# Altium schematic sheet 2_Connection.SchDoc
size 414 x 293 mm; SheetNumber: 2; SheetTotal: 3; PageSetup: Record=PageOptionsZCenterHorizontal=TrueZCenterVertical=TrueZPrintScale=1.00ZXCorrection=0.00ZYCorrection=0.00ZPrintKind=1ZBorderSize=5000000ZLeftOffset=0ZBottomOffset=0ZOrientation=2ZPaperLength=1000ZPaperWidth=1000ZScale=100ZPaperSource=7ZPrintQuality=-4ZMediaType=1ZDitherType=10ZPaperKind=A3ZPrintScaleMode=0; Razrabotal: {Разработал}; Proveril: {Проверил}; Tkontr: {Т.контр.}; Nkontr: {Н.контр.}; Ytverdil: {Утвердил}; Nazvanie1: {Название1}; Nazvanie2: {Название2}; Oboznachenie: {Обозначение}
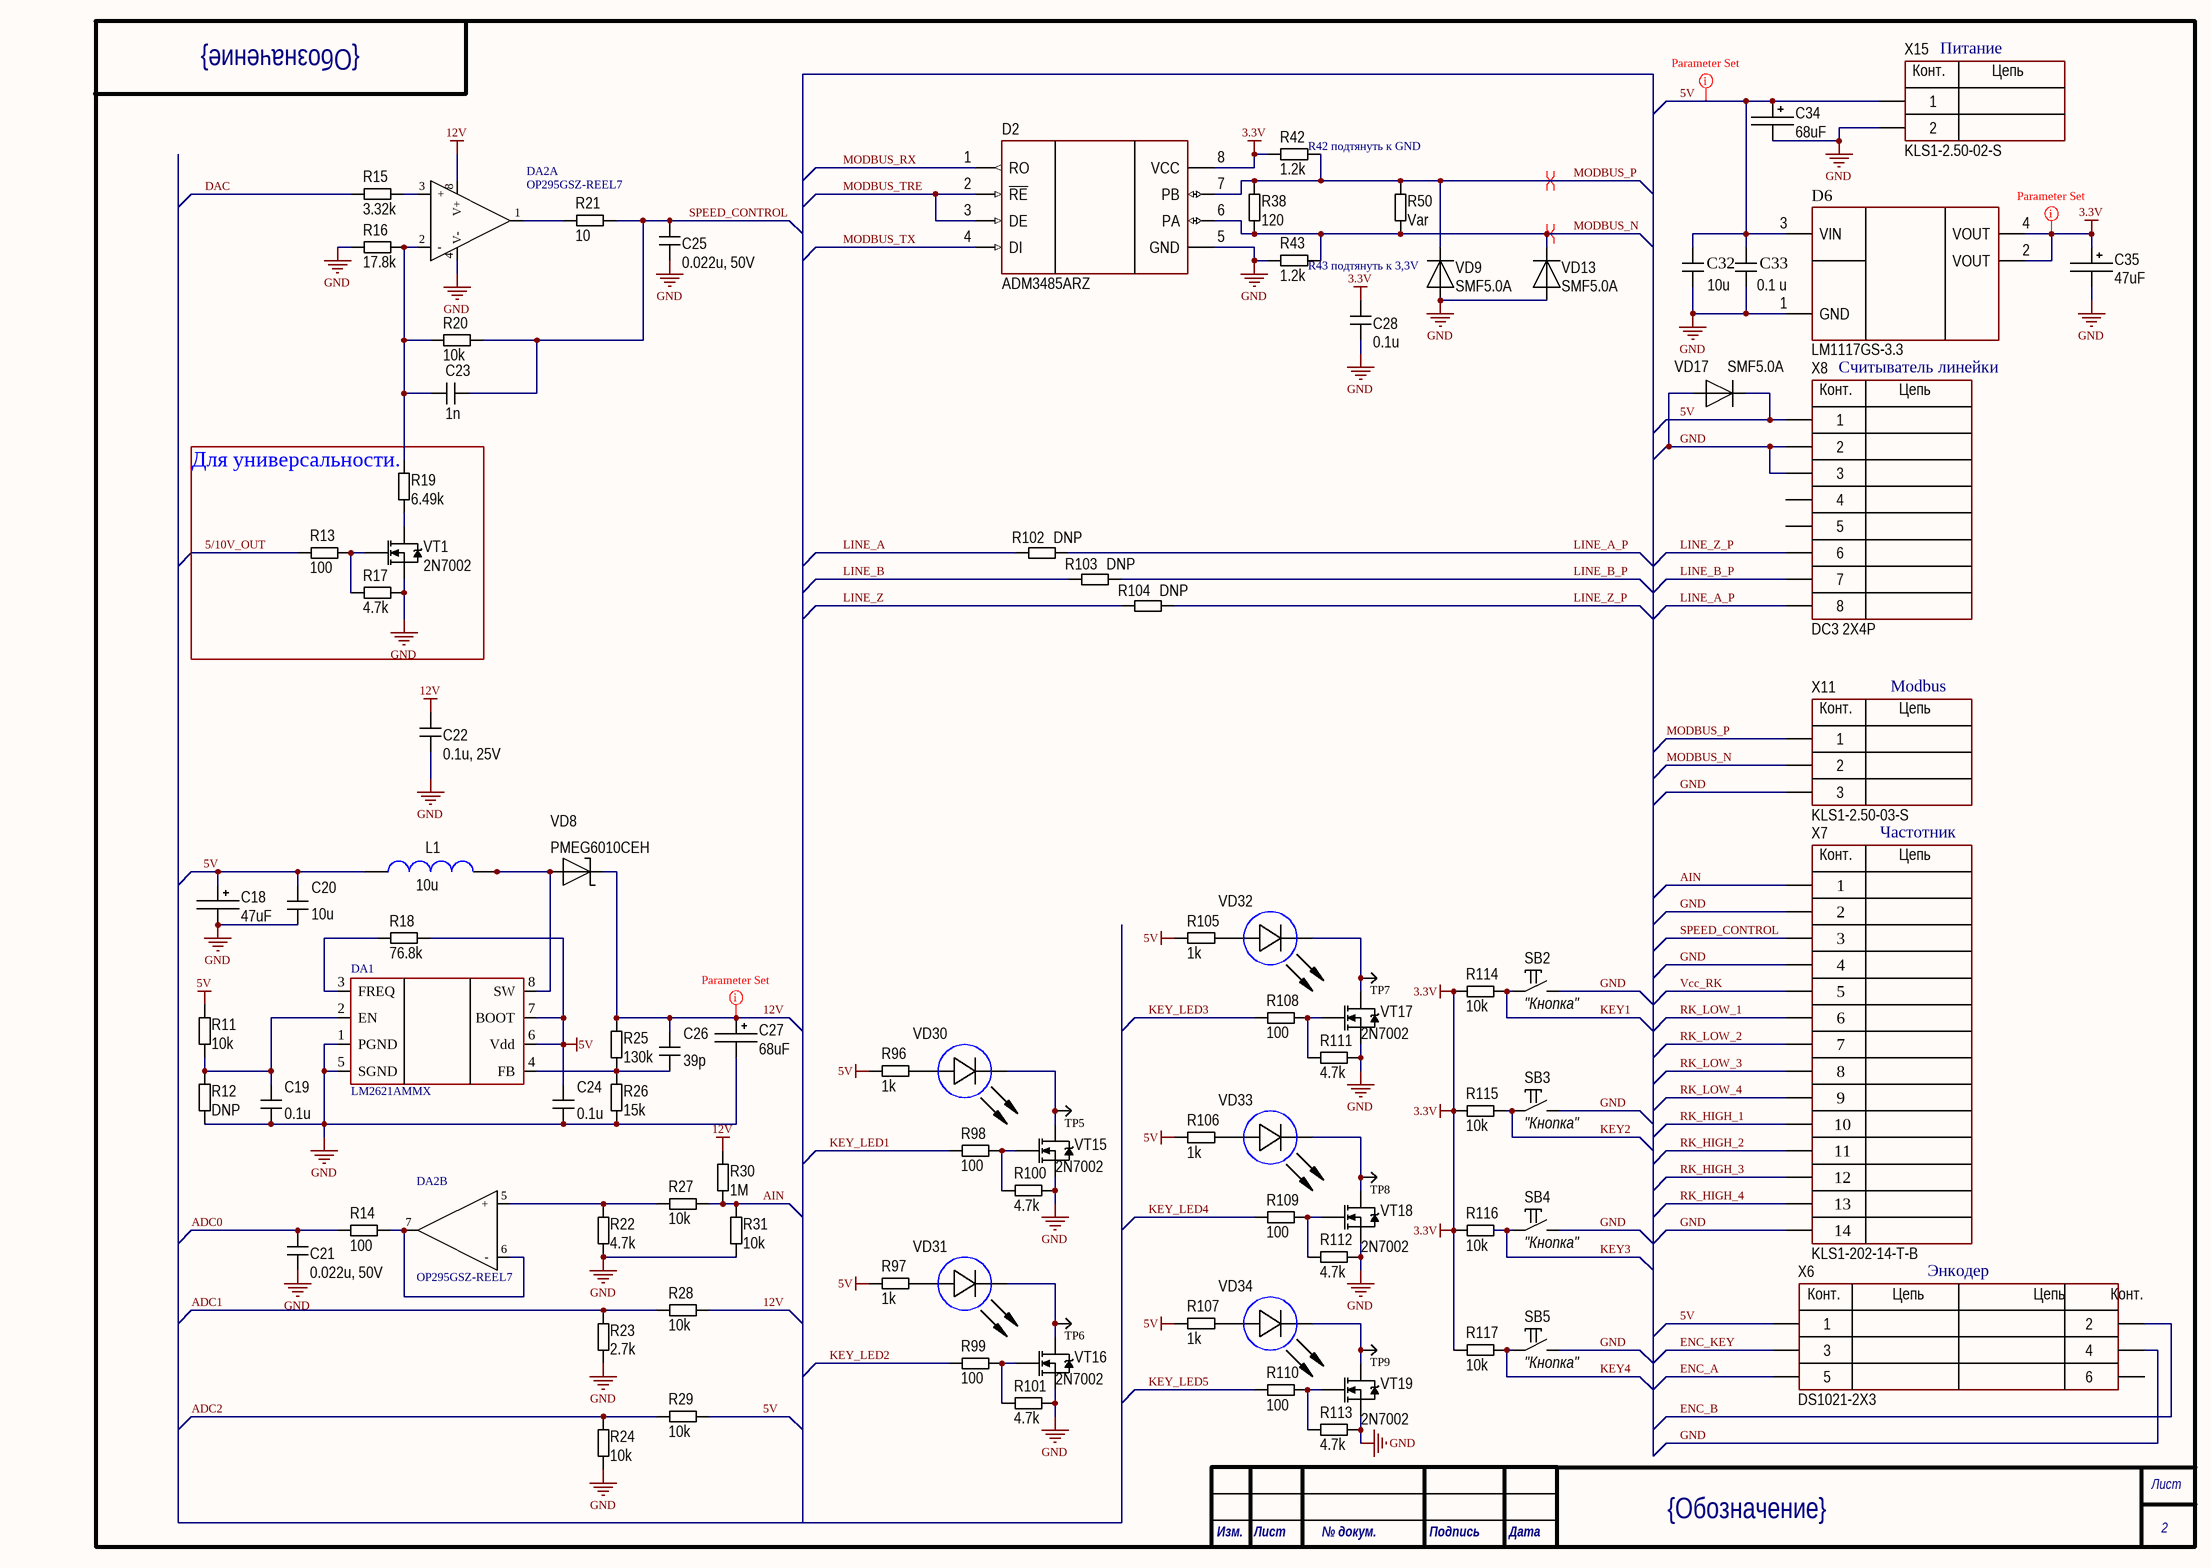
[diagram p0: 2_Connection.SchDoc]

## Parts
C18  47uF  [TANTAL_B]
C19  0.1u  [CH0603C]
C20  10u  [CH0603C]
C21  0.022u, 50V  [CH0603C]
C22  0.1u, 25V  [CH0603C]
C23  1n  [CH0603C]
C24  0.1u  [CH0603C]
C25  0.022u, 50V  [CH0603C]
C26  39p  [CH0603C]
C27  68uF  [TANTAL_D]
C28  0.1u  [CH0603C]
C32  10u  [CH0805C]
C33  0.1 u  [CH0603C]
C34  68uF  [TANTAL_B]
C35  47uF  [TANTAL_A]
D2  ADM3485ARZ  [8-SOIC]
D6  LM1117GS-3.3  [SOT223]
DA1  LM2621AMMX  [8-SSOP]
DA2  OP295GSZ-REEL7  [8-SOIC]  (parts A,B of 2)
L1  10u  [IND: IHLP2020]
R11  10k  [CH0603R]
R12  DNP  [CH0603R]
R13  100  [CH0603R]
R14  100  [CH0603R]
R15  3.32k  [CH0603R]
R16  17.8k  [CH0603R]
R17  4.7k  [CH0603R]
R18  76.8k  [CH0603R]
R19  6.49k  [CH0603R]
R20  10k  [CH0603R]
R21  10  [CH0603R]
R22  4.7k  [CH0603R]
R23  2.7k  [CH0603R]
R24  10k  [CH0603R]
R25  130k  [CH0603R]
R26  15k  [CH0603R]
R27  10k  [CH0603R]
R28  10k  [CH0603R]
R29  10k  [CH0603R]
R30  1M  [CH0603R]
R31  10k  [CH0603R]
R38  120  [CH1206R]
R42  1.2k  [CH0603R]
R43  1.2k  [CH0603R]
R50  Var  [CH1206R]
R96  1k  [CH0805R]
R97  1k  [CH0805R]
R98  100  [CH0603R]
R99  100  [CH0603R]
R100  4.7k  [CH0603R]
R101  4.7k  [CH0603R]
R102  DNP  [CH0603R]
R103  DNP  [CH0603R]
R104  DNP  [CH0603R]
R105  1k  [CH0805R]
R106  1k  [CH0805R]
R107  1k  [CH0805R]
R108  100  [CH0603R]
R109  100  [CH0603R]
R110  100  [CH0603R]
R111  4.7k  [CH0603R]
R112  4.7k  [CH0603R]
R113  4.7k  [CH0603R]
R114  10k  [CH0603R]
R115  10k  [CH0603R]
R116  10k  [CH0603R]
R117  10k  [CH0603R]
SB2  "Кнопка"  [BUT: SKQGADE010]
SB3  "Кнопка"  [BUT: SKQGADE010]
SB4  "Кнопка"  [BUT: SKQGADE010]
SB5  "Кнопка"  [BUT: SKQGADE010]
TP5  (no value)  [TestPoint]
TP6  (no value)  [TestPoint]
TP7  (no value)  [TestPoint]
TP8  (no value)  [TestPoint]
TP9  (no value)  [TestPoint]
VD8  PMEG6010CEH  [SOD123F]
VD9  SMF5.0A  [SOD123F]
VD13  SMF5.0A  [SOD123F]
VD17  SMF5.0A  [SOD123F]
VD30  BLUE  [CH0603LB]  (value not drawn)
VD31  BLUE  [CH0603LB]  (value not drawn)
VD32  BLUE  [CH0603LB]  (value not drawn)
VD33  BLUE  [CH0603LB]  (value not drawn)
VD34  BLUE  [CH0603LB]  (value not drawn)
VT1  2N7002  [SOT23_123]
VT15  2N7002  [SOT23_123]
VT16  2N7002  [SOT23_123]
VT17  2N7002  [SOT23_123]
VT18  2N7002  [SOT23_123]
VT19  2N7002  [SOT23_123]
X6  DS1021-2X3  [CON: PLD-6 (without body)]
X7  KLS1-202-14-T-B  [CON: IDC-14MS]
X8  DC3 2X4P  [CON: DC3 2x4P]
X11  KLS1-2.50-03-S  [CON: CWF-3]
X15  KLS1-2.50-02-S  [CON: CWF-2]

## Blocks framed on the sheet
Для универсальности.: R13 R17 R19 VT1

## Nets
3.3V: C28.2 C35.1 D2.8(VCC) D6.2(VOUT) D6.4(VOUT) R42.2 R114.2 R115.2 R116.2 R117.2
5V: C18.1 C20.2 C24.2 C32.2 C33.2 C34.1 D6.3(VIN) DA1.6(Vdd) DA1.7(BOOT) L1.2 R11.1 R18.1 R29.1 R96.2 R97.2 R105.2 R106.2 R107.2 VD17.2 X6.1 X8.1 X15.1
12V: C22.2 C26.2 C27.1 DA2.8(V+) R25.1 R28.1 R30.1 VD8.2
GND: C18.2 C19.1 C20.1 C21.1 C22.1 C24.1 C25.1 C27.2 C28.1 C32.1 C33.1 C34.2 C35.2 D2.5(GND) D6.1(GND) DA1.1(PGND) DA1.5(SGND) DA2.4(V-) R12.2 R16.2 R17.1 R22.2 R23.2 R24.2 R26.2 R31.2 R43.2 R100.1 R101.1 R111.1 R112.1 R113.1 SB2.2 SB3.2 SB4.2 SB5.2 VD9.1 VD13.1 VD17.1 VT1.3(S) VT15.3(S) VT16.3(S) VT17.3(S) VT18.3(S) VT19.3(S) X6.4 X7.2 X7.4 X7.14 X8.2 X8.3 X11.3 X15.2
5/10V_OUT: R13.2
ADC0: C21.2 R14.1
ADC1: R23.1 R28.2
ADC2: R24.1 R29.2
AIN: R27.1 R30.2 R31.1 X7.1
DAC: R15.2
ENC_A: X6.5
ENC_B: X6.2
ENC_KEY: X6.3
KEY1: R114.1 SB2.1
KEY2: R115.1 SB3.1
KEY3: R116.1 SB4.1
KEY4: R117.1 SB5.1
KEY_LED1: R98.2
KEY_LED2: R99.2
KEY_LED3: R108.2
KEY_LED4: R109.2
KEY_LED5: R110.2
LINE_A: R102.2
LINE_A_P: R102.1 X8.8
LINE_B: R103.2
LINE_B_P: R103.1 X8.7
LINE_Z: R104.2
LINE_Z_P: R104.1 X8.6
MODBUS_N: D2.6(PA) R38.1 R43.1 R50.1 VD13.2 X11.2
MODBUS_P: D2.7(PB) R38.2 R42.1 R50.2 VD9.2 X11.1
MODBUS_RX: D2.1(RO)
MODBUS_TRE: D2.2(~{RE}) D2.3(DE)
MODBUS_TX: D2.4(DI)
RK_HIGH_1: X7.10
RK_HIGH_2: X7.11
RK_HIGH_3: X7.12
RK_HIGH_4: X7.13
RK_LOW_1: X7.6
RK_LOW_2: X7.7
RK_LOW_3: X7.8
RK_LOW_4: X7.9
SPEED_CONTROL: C23.1 C25.2 R20.1 R21.1 X7.3
Vcc_RK: X7.5
NetC19_2: C19.2 DA1.2(EN) R11.2 R12.1
NetC23_2: C23.2 DA2.2(-) R16.1 R19.1 R20.2
NetC26_1: C26.1 DA1.4(FB) R25.2 R26.1
NetDA1_3: DA1.3(FREQ) R18.2
NetDA1_8: DA1.8(SW) L1.1 VD8.1
NetDA2_1: DA2.1(OUT) R21.2
NetDA2_3: DA2.3(+) R15.1
NetDA2_5: DA2.5(+) R22.1 R27.2
NetDA2_6: DA2.6(-) DA2.7(OUT) R14.2
NetR13_1: R13.1 R17.2 VT1.1(G)
NetR19_2: R19.2 VT1.2(D)
NetR96_1: R96.1 VD30.1(A)
NetR97_1: R97.1 VD31.1(A)
NetR98_1: R98.1 R100.2 VT15.1(G)
NetR99_1: R99.1 R101.2 VT16.1(G)
NetR105_1: R105.1 VD32.1(A)
NetR106_1: R106.1 VD33.1(A)
NetR107_1: R107.1 VD34.1(A)
NetR108_1: R108.1 R111.2 VT17.1(G)
NetR109_1: R109.1 R112.2 VT18.1(G)
NetR110_1: R110.1 R113.2 VT19.1(G)
NetTP5_0: TP5.0 VD30.2(C) VT15.2(D)
NetTP6_0: TP6.0 VD31.2(C) VT16.2(D)
NetTP7_0: TP7.0 VD32.2(C) VT17.2(D)
NetTP8_0: TP8.0 VD33.2(C) VT18.2(D)
NetTP9_0: TP9.0 VD34.2(C) VT19.2(D)

Not connected (* = marked no-connect by the designer): X6 6; X8 4 5

## Layout directives
differential pair: MODBUS_N, MODBUS_P
rule Supply Nets [Voltage = 5.000]: 5V
rule Supply Nets [Voltage = 12.00]: 12V
rule Supply Nets [Voltage = 3.300]: 3.3V

## Notes on the sheet
- Питание
- (near R42) R42 подтянуть к GND
- (near R43) R43 подтянуть к 3,3V
- Считыватель линейки
- Modbus
- Частотник
- (near X6) Энкодер
- Лист
- Изм.
- № докум.
- Подпись
- Дата
- (in symbol 2-Connector) Конт.; Цепь
- (in symbol 3-Connector) Конт.; Цепь
- (in symbol 6(2)-Connector) Конт.; Цепь
- (in symbol 8-Connector) Конт.; Цепь
- (in symbol 14-Connector) Конт.; Цепь

## Library data of the parts
C18 = TantalCap: Model: 293D476X9010B2TE3; Manufacturer: *; HelpURL: *; ComponentKind: *; Value: 47uF
C19 C22 C24 C28 C33 = Capacitor: Model: 06035C104JAT2A; Manufacturer: *; HelpURL: *; ComponentKind: *
  C19 C24 C28: Value: 0.1u
  C22: Value: 0.1u, 25V
  C33: Value: 0.1 u
C20 C32 = Capacitor: Model: GRM21BR71A106KE51; Manufacturer: *; HelpURL: *; ComponentKind: *; Value: 10u
C21 C25 = Capacitor: Model: 06035C223JAT2A; Manufacturer: *; HelpURL: *; ComponentKind: *; Value: 0.022u, 50V
C23 = Capacitor: Model: 06035A102JAT2A; Manufacturer: *; HelpURL: *; ComponentKind: *; Value: 1n
C26 = Capacitor: Model: CC0603JRNPO9BN390; Manufacturer: *; HelpURL: *; ComponentKind: *; Value: 39p
C27 = TantalCap: Model: 293D686X9020D2TE3; Manufacturer: *; HelpURL: *; ComponentKind: *; Value: 68uF
C34 = TantalCap: Model: 293D686X9010B2TE3; Manufacturer: *; HelpURL: *; ComponentKind: *; Value: 68uF
C35 = TantalCap: Model: 293D476X96R3A2TE3; Manufacturer: *; HelpURL: *; ComponentKind: *; Value: 47uF
D2 = ADM3485ARZ: RS485; Manufacturer: Analog Devices Inc.; Model: ADM3485ARZ-REEL7; HelpURL: https://www.digikey.com/product-detail/en/analog-devices-inc/ADM3485ARZ-REEL7/ADM3485ARZ-REEL7CT-ND/3878705; ComponentKind: 8-SOIC
D6 = LDL1117S33R: LDO; Manufacturer: STMicroelectronics; Model: LM1117GS-3.3; HelpURL: https://www.digikey.com/product-detail/en/stmicroelectronics/LDL1117S33R/497-17239-1-ND/7102079; ComponentKind: SOT-223; Value: LM1117GS-3.3
DA1 = LM2623AMMX: Model: LM2621AMMX
DA2 = OP295: Value: OP295GSZ-REEL7; Model: OP295GSZ-REEL7
L1 = Inductor: Model: IHLP2020CZER100M11; Manufacturer: *; HelpURL: *; ComponentKind: *; Value: 10u
R11 R20 R24 R27-R29 R31 R114-R117 = Resistor: Model: CR0603-FX-1002ELF; Manufacturer: *; HelpURL: *; ComponentKind: *; Value: 10k
R12 R102-R104 = Resistor: Manufacturer: *; Model: *; HelpURL: *; ComponentKind: *; Value: DNP
R13 R14 R98 R99 R108-R110 = Resistor: Model: CR0603-JW-101ELF; Manufacturer: *; HelpURL: *; ComponentKind: *; Value: 100
R15 = Resistor: Model: CR0603-FX-3321ELF; Manufacturer: *; HelpURL: *; ComponentKind: *; Value: 3.32k
R16 = Resistor: Model: CR0603-FX-1782ELF; Manufacturer: *; HelpURL: *; ComponentKind: *; Value: 17.8k
R17 R22 R100 R101 R111-R113 = Resistor: Model: CR0603-FX-4701ELF; Manufacturer: *; HelpURL: *; ComponentKind: *; Value: 4.7k
R18 = Resistor: Model: CR0603-FX-7682ELF; Manufacturer: *; HelpURL: *; ComponentKind: *; Value: 76.8k
R19 = Resistor: Model: CR0603-FX-6491ELF; Manufacturer: *; HelpURL: *; ComponentKind: *; Value: 6.49k
R21 = Resistor: Model: CR0603-FX-10R0ELF; Manufacturer: *; HelpURL: *; ComponentKind: *; Value: 10
R23 = Resistor: Model: CR0603-FX-2701ELF; Manufacturer: *; HelpURL: *; ComponentKind: *; Value: 2.7k
R25 = Resistor: Model: CR0603-FX-1303ELF; Manufacturer: *; HelpURL: *; ComponentKind: *; Value: 130k
R26 = Resistor: Model: CR0603-FX-1502ELF; Manufacturer: *; HelpURL: *; ComponentKind: *; Value: 15k
R30 = Resistor: Model: CR0603-FX-1004ELF; Manufacturer: *; HelpURL: *; ComponentKind: *; Value: 1M
R38 = Resistor: Model: CR1206-FX-1200ELF; Manufacturer: *; HelpURL: *; ComponentKind: *; Value: 120
R42 R43 = Resistor: Model: CR0603-FX-1201ELF; Manufacturer: *; HelpURL: *; ComponentKind: *; Value: 1.2k
R50 = Resistor: Model: JMV0805S5R6T661; Manufacturer: *; HelpURL: *; ComponentKind: *; Value: Var; Part: JMV0805S5R6T661
R96 R97 R105-R107 = Resistor: Model: CR0805-FX-1001ELF; Manufacturer: *; HelpURL: *; ComponentKind: *; Value: *
SB2-SB5 = Tactile switches: 6x6 mm; Model: SKQGADE010; Manufacturer: *; HelpURL: *; ComponentKind: *
TP5-TP9 = TestPoint
VD8 = Diod Schottky: ComponentKind: *; Manufacturer: *; Model: PMEG6010CEH; HelpURL: *
VD9 VD13 VD17 = Diod: Part Num: SMAF5.0A; ComponentKind: *; Manufacturer: *; Model: SMF5.0A; HelpURL: *
VD30-VD34 = LED_1: Model: KPT-1608SGC; Manufacturer: *; HelpURL: *; ComponentKind: *; Value: *
VT1 VT15-VT19 = N-chanel: Mosfet; Model: 2N7002; Manufacturer: *; ComponentKind: *; HelpURL: *
X6 = 6(2)-Connector: Model: DS1021-2X3; Manufacturer: *; HelpURL: *; ComponentKind: *
X7 = 14-Connector: Model: KLS1-202-14-T-B; Manufacturer: *; HelpURL: *; ComponentKind: *
X8 = 8-Connector: Model: DC3 2X4P; Manufacturer: *; HelpURL: *; ComponentKind: *
X11 = 3-Connector: Model: KLS1-2.50-03-S; Manufacturer: *; HelpURL: *; ComponentKind: *
X15 = 2-Connector: Model: KLS1-2.50-02-S; Manufacturer: *; HelpURL: *; ComponentKind: *